# Altium schematic sheet hexapod_board_schematics.SchDoc
size A4; SheetNumber: 1; SheetTotal: 1
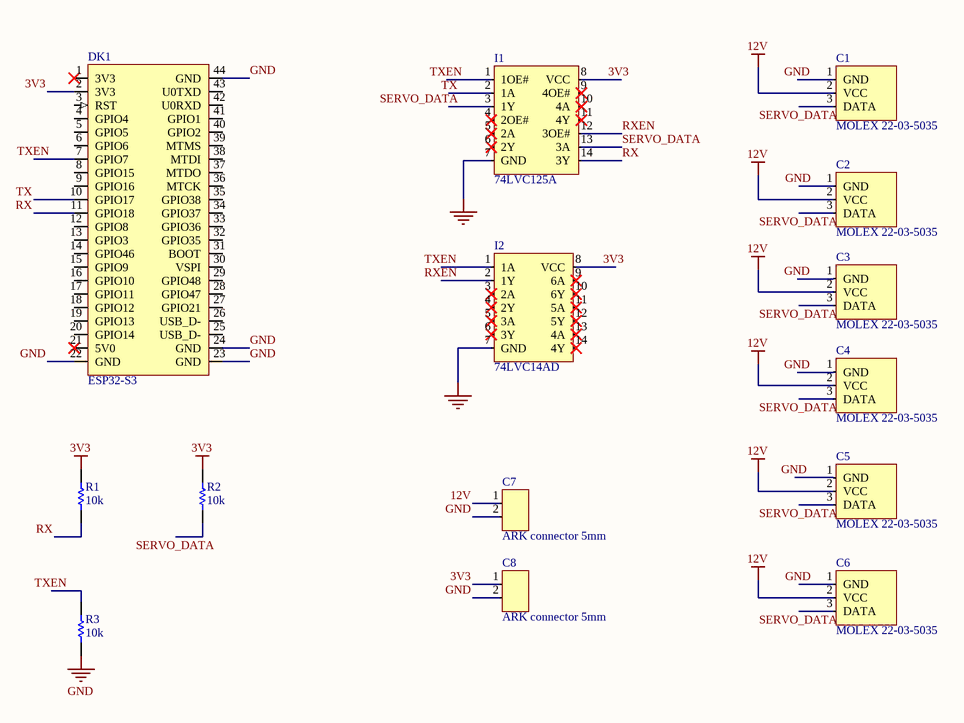
[diagram p0: hexapod_board_schematics.SchDoc]

## Parts
C1  MOLEX 22-03-5035  [PCBComponent_1]
C2  MOLEX 22-03-5035  [PCBComponent_1]
C3  MOLEX 22-03-5035  [PCBComponent_1]
C4  MOLEX 22-03-5035  [PCBComponent_1]
C5  MOLEX 22-03-5035  [PCBComponent_1]
C6  MOLEX 22-03-5035  [PCBComponent_1]
C7  ARK connector 5mm  [ARK connector footprint]
C8  ARK connector 5mm  [ARK connector footprint]
DK1  ESP32-S3  [ESP32-S3-DevKit footprint]
I1  74LVC125A  [SOP14]
I2  74LVC14AD  [SOP14]
R1  10k  [RESC2013X60X35ML10T20]
R2  10k  [RESC2013X60X35ML10T20]
R3  10k  [RESC2013X60X35ML10T20]

## Nets
3V3: C8.1 DK1.2(3V3) I1.8(VCC) I2.8(VCC) R1.2 R2.2
12V: C1.2(VCC) C2.2(VCC) C3.2(VCC) C4.2(VCC) C5.2(VCC) C6.2(VCC) C7.1
GND: C1.1(GND) C2.1(GND) C3.1(GND) C4.1(GND) C5.1(GND) C6.1(GND) C7.2 C8.2 DK1.22(GND) DK1.23(GND) DK1.24(GND) DK1.44(GND) I1.7(GND) I2.7(GND) R3.1
RX: DK1.11(GPIO18) I1.14(3Y) R1.1
RXEN: I1.12(3OE#) I2.2(1Y)
SERVO_DATA: C1.3(DATA) C2.3(DATA) C3.3(DATA) C4.3(DATA) C5.3(DATA) C6.3(DATA) I1.3(1Y) I1.13(3A) R2.1
TX: DK1.10(GPIO17) I1.2(1A)
TXEN: DK1.7(GPIO7) I1.1(1OE#) I2.1(1A) R3.2

Not connected (* = marked no-connect by the designer): DK1 1(3V3)* 3(RST) 4(GPIO4) 5(GPIO5) 6(GPIO6) 8(GPIO15) 9(GPIO16) 12(GPIO8) 13(GPIO3) 14(GPIO46) 15(GPIO9) 16(GPIO10) 17(GPIO11) 18(GPIO12) 19(GPIO13) 20(GPIO14) 21(5V0)* 25(USB_D-) 26(USB_D-) 27(GPIO21) 28(GPIO47) 29(GPIO48) 30(VSPI) 31(BOOT) 32(GPIO35) 33(GPIO36) 34(GPIO37) 35(GPIO38) 36(MTCK) 37(MTDO) 38(MTDI) 39(MTMS) 40(GPIO2) 41(GPIO1) 42(U0RXD) 43(U0TXD); I1 4(2OE#)* 5(2A)* 6(2Y)* 9(4OE#)* 10(4A)* 11(4Y)*; I2 3(2A)* 4(2Y)* 5(3A)* 6(3Y)* 9(6A)* 10(6Y)* 11(5A)* 12(5Y)* 13(4A)* 14(4Y)*

## Library data of the parts
DK1 = ESP32-S3-N16R2 DevKit
R1-R3 = CMP-2100-03673-1: Chip Resistor, 0 Ohm, Jumper, +/- 5%, 0.125 W, -55 to 155 degC, 0805 (2012 Metric), RoHS, Tape and Reel; Manufacturer: Yageo; Power Rating: 125mW; Resistance: 0mOhm; Voltage Rating (DC): 150V; Temperature Coefficient: 200ppm/degreesC; Height: 0.5mm; Depth: 1.25mm; Case Code (Imperial): 0805; Lead Free: LeadFree; Military Standard: Not; Package Description: 2-Pin Surface Mounted Device, Body 2 x 1.25 mm; Case Code (Metric): 2012; Composition: ThickFilm; Voltage Rating: 150V; Manufacturer URL: http://www.yageo.com/; Packaging: TapeandReel; Package Reference: 0805; REACH SVHC: Unknown; Tolerance: 5%; Case/Package: 0805; Max Operating Temperature: 155degC; Number of Pins: 2; Min Operating Temperature: -55degC; RoHSCompliant: true; Length: 2mm; Datasheet URL: http://www.yageo.com/NewPortal/yageodocoutput?fileName=/pdf/R-Chip/PYu-RC_Group_51_RoHS_L_5.pdf; Termination: SMD/SMT; Radiation Hardening: No; Width: 1.25mm; Contact Plating: Tin; Datasheet Version: Rev. 5, 10/2016